# EAGLE design midi_inoutthru (EAGLE 6.2)
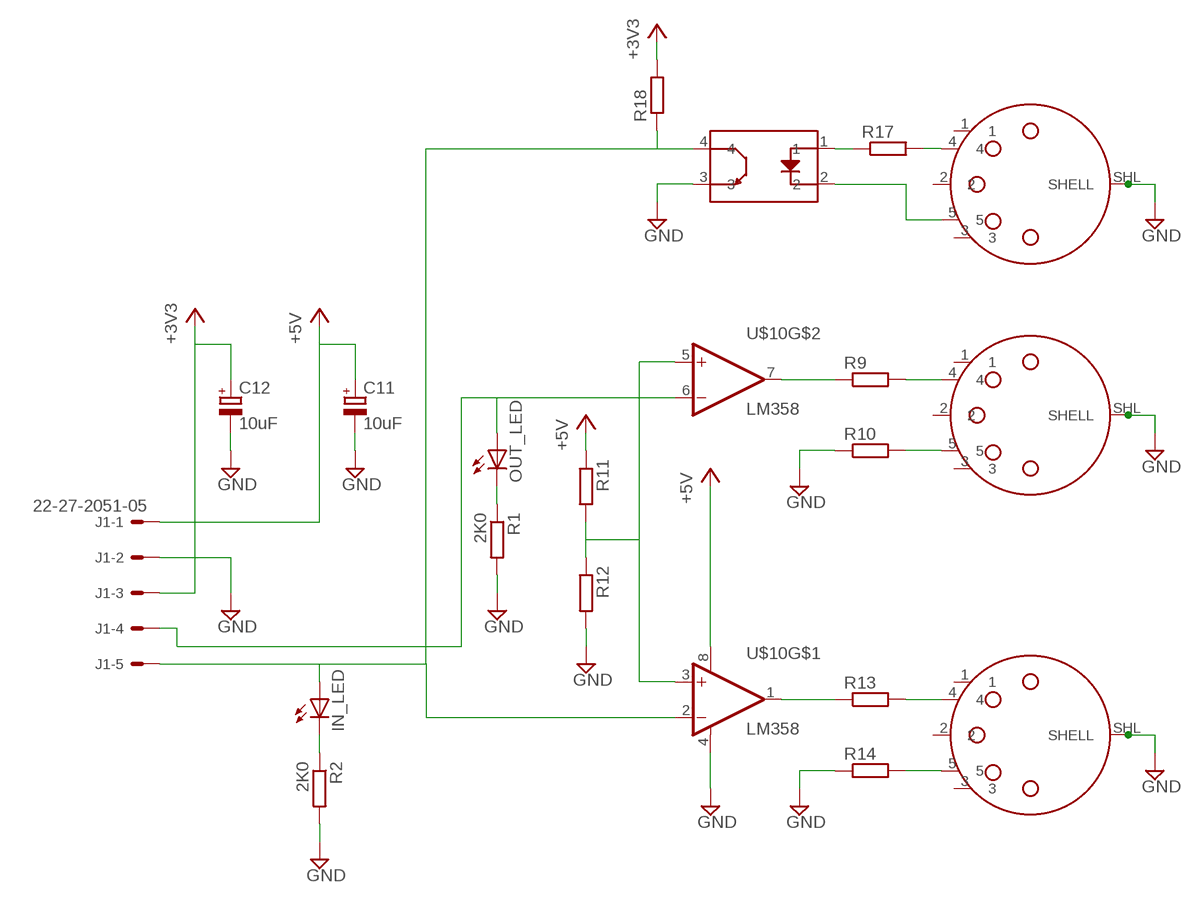
[diagram p0: schematic, sheet 1]

## Parts
C11  10uF  CPOL-EUSMCC  [SMC_C]
C12  10uF  CPOL-EUSMCC  [SMC_C]
IN_LED  LEDCHIP-LED0805  [CHIP-LED0805]
J1  22-27-2051-05  [6410-05]
OUT_LED  LEDCHIP-LED0805  [CHIP-LED0805]
R1  2K0  R-EU_R0402  [R0402]
R2  2K0  R-EU_R0402  [R0402]
R9  R-EU_R1206  [R1206]
R10  R-EU_R1206  [R1206]
R11  R-EU_R0402  [R0402]
R12  R-EU_R0402  [R0402]
R13  R-EU_R1206  [R1206]
R14  R-EU_R1206  [R1206]
R17  R-EU_R1206  [R1206]
R18  R-EU_R1206  [R1206]
U$9  MIDI_VERT  [DIN-5_VERT]
U$10  LM358  [SO08]
U$11  MIDI_VERT  [DIN-5_VERT]
U$19  F2801A  [LONG_TSOP]
U$20  MIDI_VERT  [DIN-5_VERT]

## Nets
+3V3: C12.+ J1.3 R18.2
+5V: C11.+ J1.1 R11.1 U$10.8(V+)
GND: C11.- C12.- J1.2 R1.2 R2.2 R10.1 R12.2 R14.1 U$9.SHL(SHELL) U$10.4(V-) U$11.SHL(SHELL) U$19.3 U$20.SHL(SHELL)
N$1: IN_LED.C R2.1
N$2: OUT_LED.C R1.1
N$14: R10.2 U$9.5
N$15: R9.2 U$9.4
N$16: R9.1 U$10.7(OUT)
N$17: J1.4 OUT_LED.A U$10.6(-IN)
N$18: R11.2 R12.1 U$10.3(+IN) U$10.5(+IN)
N$20: R14.2 U$11.5
N$21: R13.2 U$11.4
N$22: R13.1 U$10.1(OUT)
N$36: R17.2 U$20.4
N$39: R17.1 U$19.1
N$40: U$19.2 U$20.5
N$41: IN_LED.A J1.5 R18.1 U$10.2(-IN) U$19.4
Unconnected: U$9.1 U$9.2 U$9.3 U$11.1 U$11.2 U$11.3 U$20.1 U$20.2 U$20.3

## Library data of the parts
C11 C12 = rcl:CPOL-EU: POLARIZED CAPACITOR, European symbol
IN_LED OUT_LED = led:LED: LED OSRAM: - CHIPLED LG R971, LG N971, LY N971, LG Q971, LY Q971, LO R971, LY R971 LH N974, LH R974 LS Q976, LO Q976, LY Q976 LO Q996 - Hyper CHIPLED LW Q18S LB Q993, LB Q99A, LB R99A - SideLED LS A670, LO A670, LY A670, LG A670, LP A670 LB A673, LV A673, LT A673, LW A673 LH A674 LY A675 LS A676, LA A676, LO A676, LY A676, LW A676 LS A679, LY A679, LG A679 - Hyper Micro SIDELED® LS Y876, LA Y876, LO Y876, LY Y876 LT Y87S - SmartLED LW L88C, LW L88S LB L89C, LB L89S, LG L890 LS L89K, LO L89K, LY L89K LS L896, LA L896, LO L896, LY L896 - TOPLED LS T670, LO T670, LY T670, LG T670, LP T670 LSG T670, LSP T670, LSY T670, LOP T670, LYG T670 LG T671, LOG T671, LSG T671 LB T673, LV T673, LT T673, LW T673 LH T674 LS T676, LA T676, LO T676, LY T676, LB T676, LH T676, LSB T676, LW T676 LB T67C, LV T67C, LT T67C, LS T67K, LO T67K, LY T67K, LW E67C LS E67B, LA E67B, LO E67B, LY E67B, LB E67C, LV E67C, LT E67C LW T67C LS T679, LY T679, LG T679 LS T770, LO T770, LY T770, LG T770, LP T770 LB T773, LV T773, LT T773, LW T773 LH T774 LS E675, LA E675, LY E675, LS T675 LS T776, LA T776, LO T776, LY T776, LB T776 LHGB T686 LT T68C, LB T68C - Hyper Mini TOPLED® LB M676 - Mini TOPLED Santana® LG M470 LS M47K, LO M47K, LY M47K Source: http://www.osram.convergy.de LUXEON: - LUMILED® LXK2-PW12-R00, LXK2-PW12-S00, LXK2-PW14-U00, LXK2-PW14-V00 LXK2-PM12-R00, LXK2-PM12-S00, LXK2-PM14-U00 LXK2-PE12-Q00, LXK2-PE12-R00, LXK2-PE12-S00, LXK2-PE14-T00, LXK2-PE14-U00 LXK2-PB12-K00, LXK2-PB12-L00, LXK2-PB12-M00, LXK2-PB14-N00, LXK2-PB14-P00, LXK2-PB14-Q00 LXK2-PR12-L00, LXK2-PR12-M00, LXK2-PR14-Q00, LXK2-PR14-R00 LXK2-PD12-Q00, LXK2-PD12-R00, LXK2-PD12-S00 LXK2-PH12-R00, LXK2-PH12-S00 LXK2-PL12-P00, LXK2-PL12-Q00, LXK2-PL12-R00 Source: www.luxeon.com KINGBRIGHT: KA-3528ASYC Source: www.kingbright.com
J1 = con-molex:22-?-05: CONNECTOR wire to board 2.54 mm (.1 inch) pitch header; OC_FARNELL: unknown; OC_NEWARK: unknown
R1 R2 R9-R14 R17 R18 = rcl:R-EU_: RESISTOR, European symbol
U$9 U$11 U$20 = synth_design:MIDI_VERT
U$10 = synth_design:LM358
U$19 = synth_design:F2801A

## Board
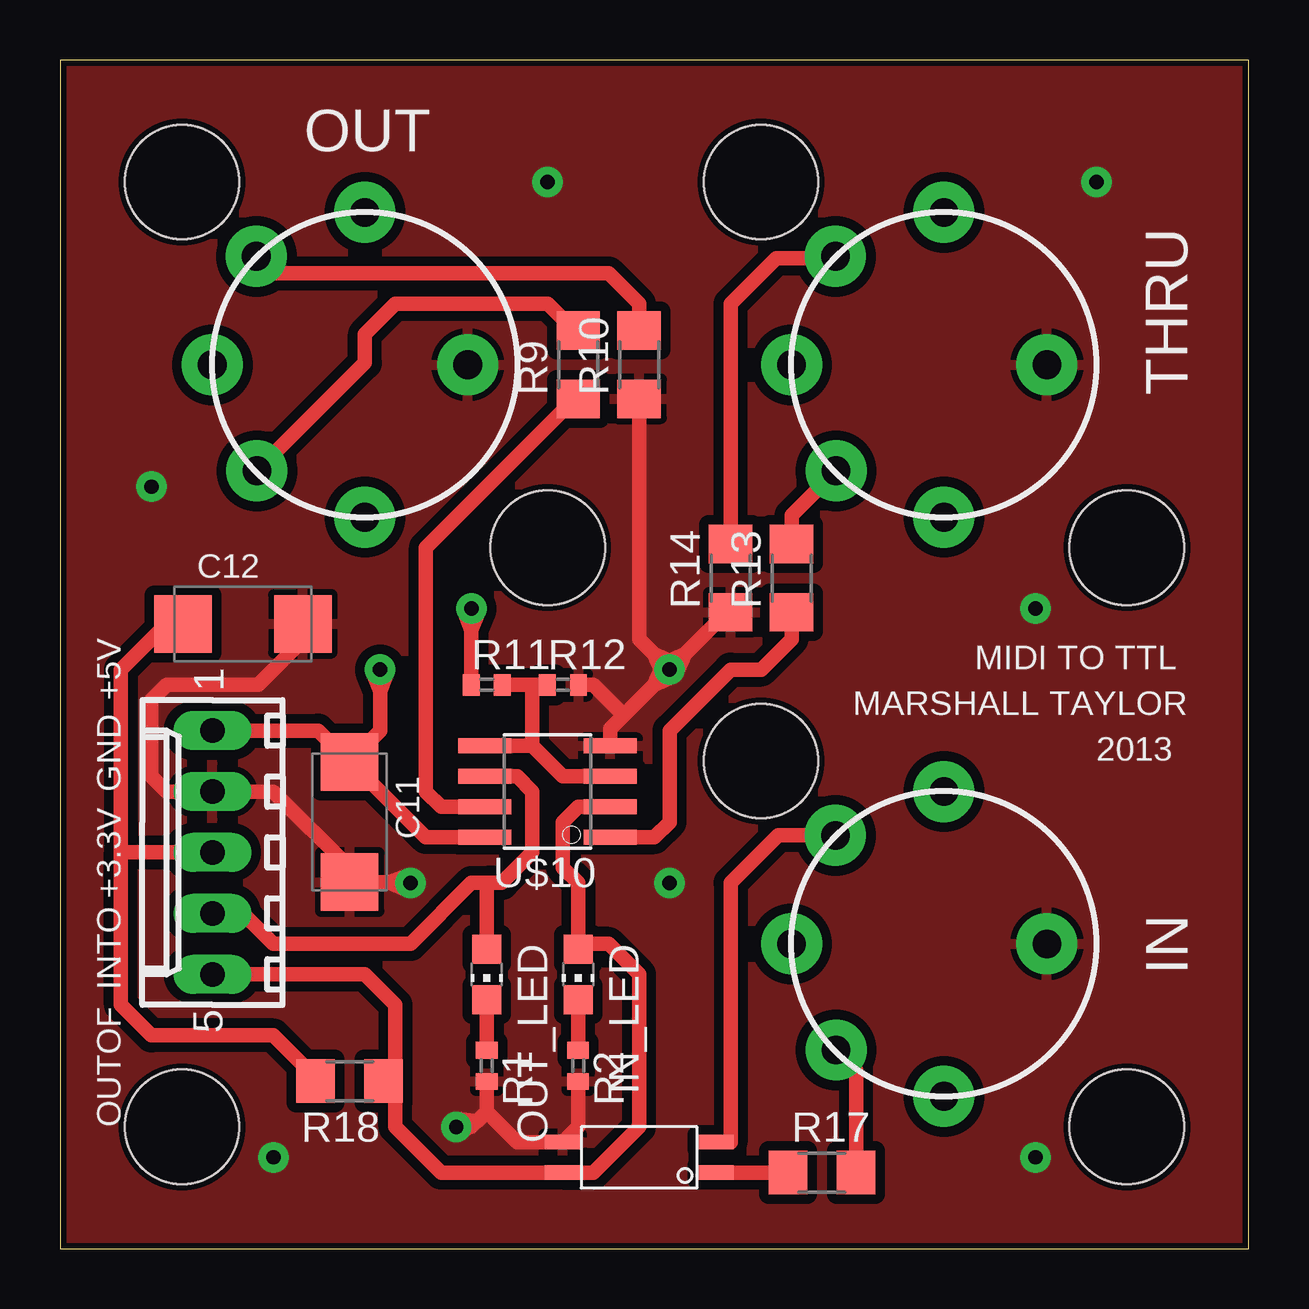
[diagram p1: board, top side]
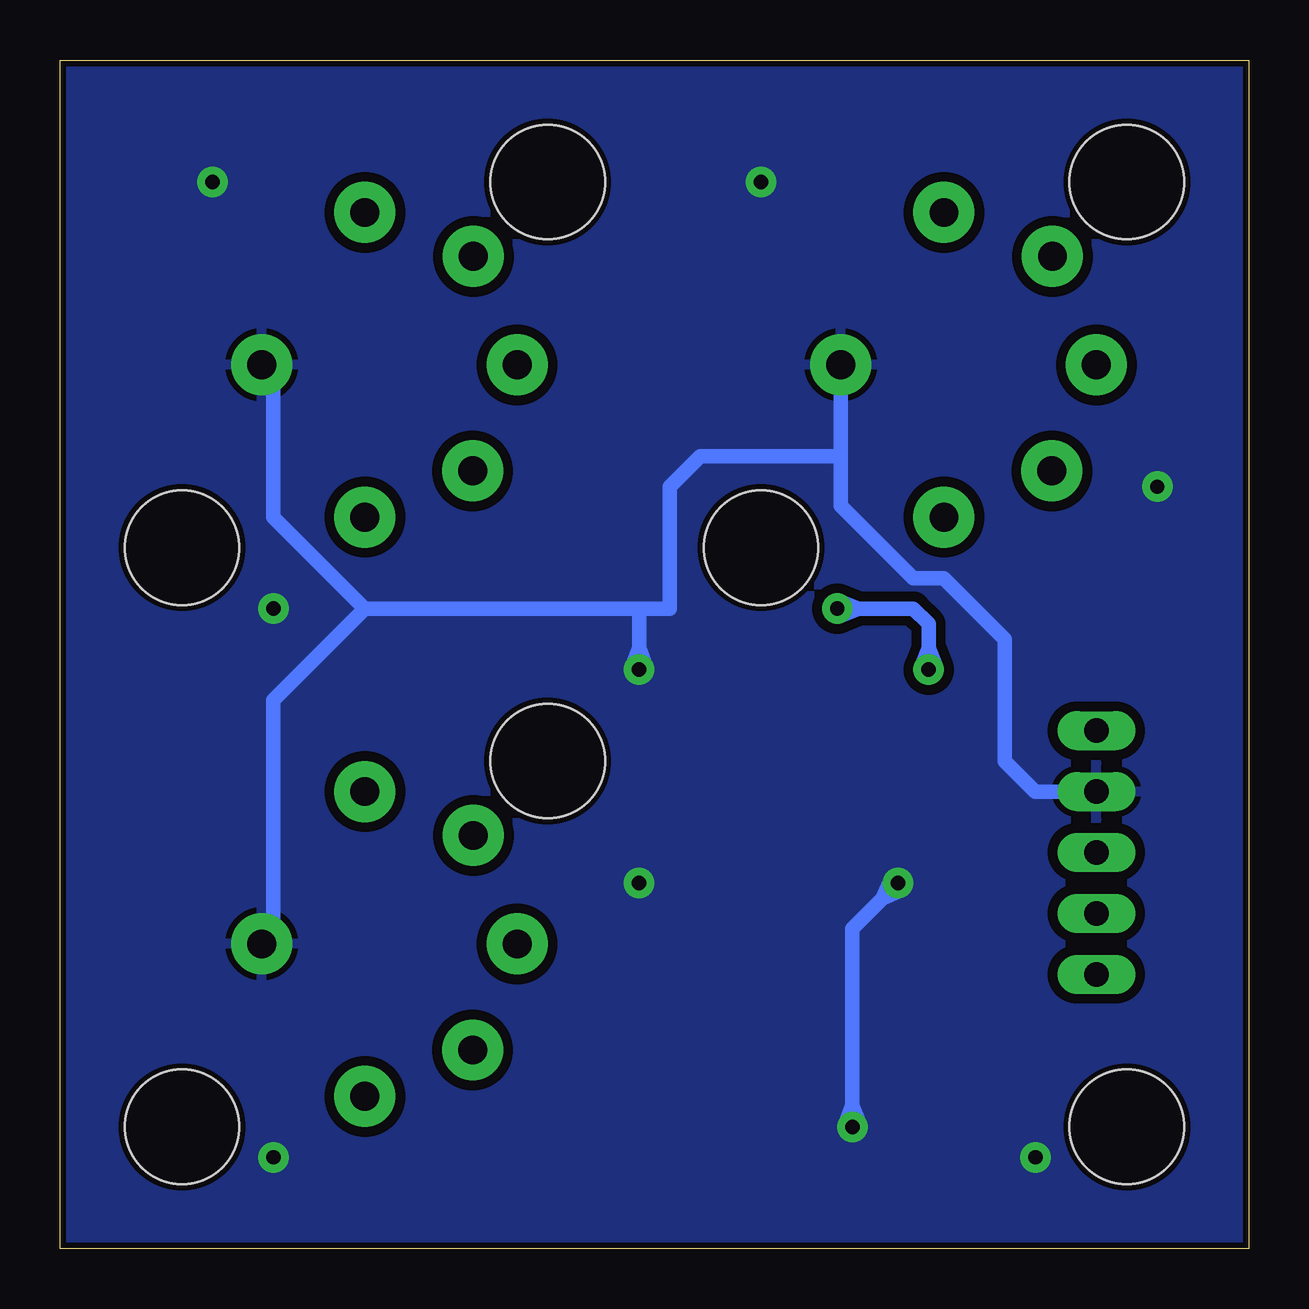
[diagram p2: board, bottom side, seen from below]

Size 49.53 x 49.53 mm. Coordinates in mm from the lower left corner, seen from the top.
Outline: 0,0 49.53,0 49.53,49.53 0,49.53 0,0
Copper layers (1*16): Top 0.035mm / dielectric 1.5mm / Bottom 0.035mm
Design rules "default": minimum track width 6mil, minimum drill 12mil, track to track 16mil, track to pad 16mil, pad to pad 16mil, via to via 16mil, smd to smd 0mil, copper to edge 10mil, drill to drill 10mil, minimum pad ring 12mil, minimum via ring 8mil, stop-mask expansion 2mil, vias tented up to drill 25mil, thermal gap 10mil
Holes 4.76 mm at 5.08,5.08 44.45,29.21 20.32,29.21 29.21,20.32 44.45,5.08 29.21,44.45 5.08,44.45

### Footprints (pad centres in the part's own frame; a part is rotated, then mirrored left to right if it is on the bottom)
SMC_C = smd 2.4 x 2.4: + -2.5,0; - 2.5,0
CHIP-LED0805 = smd 1.2 x 1.2: A 0,-1.05; C 0,1.05
6410-05 = drill 1.016 long: 1 5.08,0; 2 2.54,0; 3 0,0; 4 -2.54,0; 5 -5.08,0
R0402 = smd 0.7 x 0.9: 1 -0.65,0; 2 0.65,0
R1206 = smd 1.6 x 1.803: 1 -1.422,0; 2 1.422,0
DIN-5_VERT = drill 1.2 pad 2.54: 1 0,-6.35; 2 -6.35,0; 3 0,6.35; 4 -4.496,-4.42; 5 -4.521,4.521; SHL 4.293,0
SO08 = smd 0.61 x 2.21: 1 -1.905,-2.616; 2 -0.635,-2.616; 3 0.635,-2.616; 4 1.905,-2.616; 5 1.905,2.616; 6 0.635,2.616; 7 -0.635,2.616; 8 -1.905,2.616
LONG_TSOP = smd 1.524 x 0.61: 1 -3.175,0.635; 2 -3.175,-0.635; 3 3.175,-0.635; 4 3.175,0.635

### Placement (x,y rotation side)
C11  12.06,17.78 270 top
C12  7.62,26.04 0 top
IN_LED  21.59,11.43 180 top
J1  6.35,16.51 90 top
OUT_LED  17.78,11.43 180 top
R1  17.78,7.62 270 top
R2  21.59,7.62 270 top
R9  21.59,36.83 90 top
R10  24.13,36.83 90 top
R11  17.78,23.5 0 top
R12  20.95,23.5 0 top
R13  30.48,27.94 90 top
R14  27.94,27.94 90 top
R17  31.75,3.17 0 top
R18  12.06,6.99 180 top
U$9  12.7,36.83 0 top
U$10  20.32,19.05 90 top
U$11  36.83,36.83 0 top
U$19  24.13,3.81 180 top
U$20  36.83,12.7 0 top

### Tracks (layer width: path | path; a pad name or v marks a point on that pad's centre or on a via)
+3V3
  Top 0.61: R18.2 10.64,7.14 8.89,8.89 3.81,8.89 2.54,10.16 2.54,16.51 | 2.54,16.51 J1.3 | C12.+ 4.45,26.04 2.54,24.13 2.54,16.51
+5V  (via drill 0.6 pad 1.27)
  Top 0.61: C11.+ 12.06,20.32 13.34,21.59 13.34,23.23 | 13.34,23.23 v13.34,24.13 | v17.14,26.67 17.14,25.77 | 17.14,25.77 17.14,23.51 R11.1 | U$10.8 15.24,17.14 12.11,20.28 C11.+ | J1.1 10.76,21.59 C11.+ | 13.34,23.23 13.64,24.01 v13.34,24.13 | 13.34,23.23 13.03,24.01 v13.34,24.13 | 17.14,25.77 17.45,26.55 v17.14,26.67 | 17.14,25.77 16.84,26.55 v17.14,26.67
  Bottom 0.61: v13.34,24.13 13.34,25.03 | 13.34,25.03 13.34,26.04 13.97,26.67 16.25,26.67 | 16.25,26.67 v17.14,26.67 | 13.34,25.03 13.03,24.25 v13.34,24.13 | 13.34,25.03 13.64,24.25 v13.34,24.13 | 16.25,26.67 17.02,26.36 v17.14,26.67 | 16.25,26.67 17.02,26.98 v17.14,26.67
GND  (via drill 0.6 pad 1.27)
  Top 0.61: R2.2 21.59,5.08 U$19.3 19.05,4.45 17.78,5.71 | U$10.4 22.94,21.67 23.5,22.23 | 23.5,22.23 24.76,23.49 | 24.76,23.49 v25.4,24.13 | R1.2 17.78,5.71 | C12.- 10.12,25.36 8.26,23.5 4.45,23.5 3.81,22.86 3.81,19.68 4.45,19.05 J1.2 8.89,19.05 12.06,15.88 C11.- 13.71,15.28 | R10.1 24.13,25.4 24.76,24.77 | 24.76,24.77 v25.4,24.13 | R14.1 27.79,26.52 26.04,24.77 | 26.04,24.77 v25.4,24.13 | 13.71,15.28 14.56,15.28 v14.61,15.24 | v16.51,5.08 17.14,5.08 17.38,5.31 | 17.38,5.31 17.78,5.71 | R12.2 22.23,23.5 23.5,22.23 | 24.76,23.49 25.53,23.83 v25.4,24.13 | 24.76,23.49 25.1,24.26 v25.4,24.13 | 24.76,24.77 25.1,24 v25.4,24.13 | 24.76,24.77 25.53,24.43 v25.4,24.13 | 26.04,24.77 25.27,24.43 v25.4,24.13 | 26.04,24.77 25.7,24 v25.4,24.13 | 13.71,15.28 14.47,14.94 v14.61,15.24 | 13.71,15.28 14.5,15.55 v14.61,15.24 | 17.38,5.31 16.55,5.41 v16.51,5.08 | 17.38,5.31 16.71,4.82 v16.51,5.08
  Bottom 0.61: v25.4,24.13 25.4,25.03 | 25.4,25.03 25.4,26.67 | 25.4,26.67 36.83,26.67 | 36.83,26.67 40.64,30.48 40.64,36.35 U$11.SHL | 36.83,26.67 40.64,22.86 40.64,13.18 U$20.SHL | U$9.SHL 16.99,33.02 | 16.99,33.02 16.99,30.96 13.97,27.94 12.7,27.94 10.16,25.4 10.16,20.32 8.89,19.05 J1.2 | 25.4,26.67 24.13,26.67 24.13,31.75 22.86,33.02 16.99,33.02 | v14.61,15.24 15.24,14.6 | 15.24,14.6 16.51,13.34 16.51,5.98 | 16.51,5.98 v16.51,5.08 | 25.4,25.03 25.09,24.25 v25.4,24.13 | 25.4,25.03 25.71,24.25 v25.4,24.13 | 15.24,14.6 14.91,15.37 v14.61,15.24 | 15.24,14.6 14.47,14.94 v14.61,15.24 | 16.51,5.98 16.2,5.2 v16.51,5.08 | 16.51,5.98 16.82,5.2 v16.51,5.08
  other vias: 3.81,31.75 40.64,26.67 25.4,15.24 8.89,3.81 40.64,3.81 20.32,44.45 43.18,44.45
  pour Top: 0,49.53 49.53,49.53 49.53,0 0,0
  pour Bottom: 0,49.53 0,0 49.53,0 49.53,49.53
N$1
  Top 0.61: R2.1 IN_LED.C
N$2
  Top 0.61: OUT_LED.C R1.1
N$14
  Top 0.61: U$9.5 8.89,40.64 22.86,40.64 24.13,39.37 R10.2
N$15
  Top 0.61: U$9.4 12.7,36.91 12.7,38.1 13.97,39.37 20.32,39.37 21.44,38.25 R9.2
N$16
  Top 0.61: U$10.7 15.88,18.41 15.24,19.05 15.24,29.21 21.44,35.41 R9.1
N$17
  Top 0.61: 17.78,15.24 17.14,15.24 14.61,12.7 8.89,12.7 7.62,13.97 J1.4 | 17.78,15.24 OUT_LED.A | U$10.6 19.05,19.68 19.68,19.05 19.68,16.51 18.41,15.24 17.78,15.24
N$18
  Top 0.61: R11.2 19.68,23.5 | 19.68,23.5 R12.1 | U$10.3 20.95,19.68 19.68,20.95 | 19.68,20.95 U$10.5 | 19.68,20.95 19.68,23.5
N$20
  Top 0.61: R14.2 27.94,39.37 29.84,41.27 32.23,41.27 U$11.5
N$21
  Top 0.61: R13.2 30.48,30.56 U$11.4
N$22
  Top 0.61: U$10.1 24.77,17.14 25.4,17.78 25.4,21.59 27.94,24.13 29.21,24.13 30.48,25.4 R13.1
N$36
  Top 0.61: R17.2 33.17,7.44 U$20.4
N$39
  Top 0.61: R17.1 U$19.1
N$40
  Top 0.61: U$20.5 29.92,17.22 27.94,15.24 27.94,4.45 U$19.2
N$41
  Top 0.61: U$10.2 21.59,18.41 20.95,17.78 20.95,15.88 21.59,15.24 IN_LED.A 21.81,12.7 22.86,12.7 24.13,11.43 24.13,5.08 22.23,3.17 U$19.4 15.88,3.17 13.97,5.08 13.97,6.5 R18.1 13.97,7.47 13.97,10.16 12.7,11.43 J1.5

### Text on the board
tNames: OUT | THRU | MIDI TO TTL | +5V | MARSHALL TAYLOR | 2013 | GND | +3.3V | INTO | IN | OUTOF